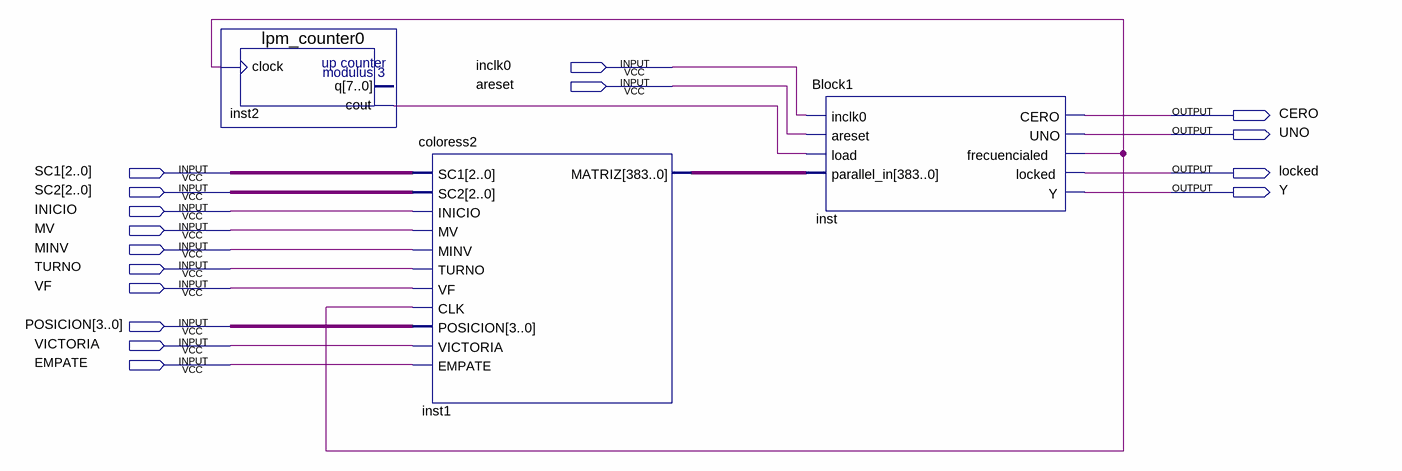
[diagram p0: schematic sheet]
// Quartus schematic subsistema2esquematico.bdf as structural Verilog: 3 symbols, 16 pins
module subsistema2esquematico (
  input  inclk0,
  input  areset,
  input  [2:0] SC1,
  input  [2:0] SC2,
  input  INICIO,
  input  MV,
  input  MINV,
  input  TURNO,
  input  VF,
  input  [3:0] POSICION,
  input  VICTORIA,
  input  EMPATE,
  output CERO,
  output UNO,
  output locked,
  output Y
);

  wire inst2_cout, inst_frecuencialed;
  wire [383:0] inst1_matriz;

  lpm_counter0 inst2 (.clock(inst_frecuencialed), .cout(inst2_cout));  // open: q
  coloress2 inst1 (
    .SC1(SC1), .SC2(SC2), .INICIO(INICIO), .MV(MV), .MINV(MINV), .TURNO(TURNO), .VF(VF),
    .CLK(inst_frecuencialed), .POSICION(POSICION), .VICTORIA(VICTORIA), .EMPATE(EMPATE), .MATRIZ(inst1_matriz));
  Block1 inst (
    .inclk0(inclk0), .areset(areset), .load(inst2_cout), .parallel_in(inst1_matriz), .CERO(CERO), .UNO(UNO),
    .frecuencialed(inst_frecuencialed), .locked(locked), .Y(Y));
endmodule
